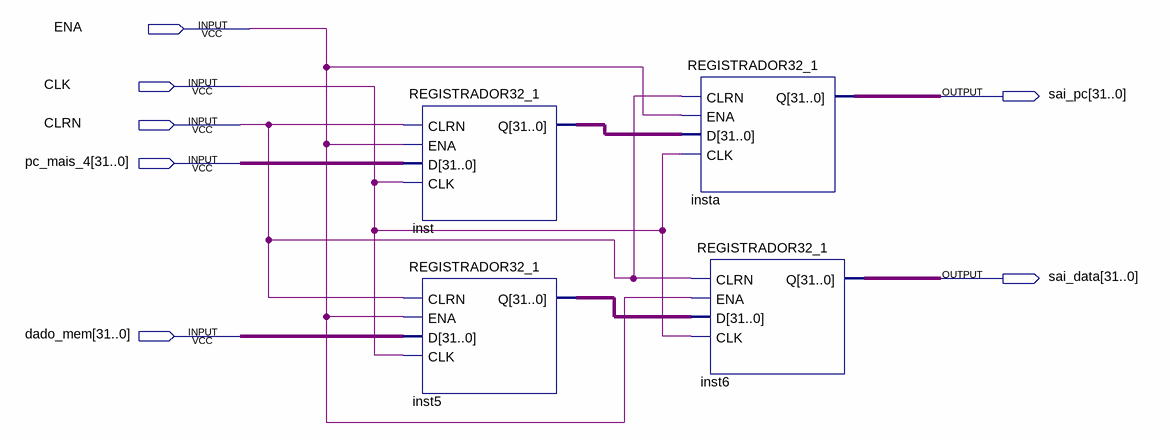
[diagram p0: schematic sheet]
// Quartus schematic IF_PARA_ID.bdf as structural Verilog: 4 symbols, 7 pins
module IF_PARA_ID (
  input  ENA,
  input  CLK,
  input  CLRN,
  input  [31:0] pc_mais_4,
  input  [31:0] dado_mem,
  output [31:0] sai_pc,
  output [31:0] sai_data
);

  wire [31:0] inst5_q, inst_q;

  REGISTRADOR32_1 inst (.CLRN(CLRN), .ENA(ENA), .D(pc_mais_4), .CLK(CLK), .Q(inst_q));
  REGISTRADOR32_1 inst5 (.CLRN(CLRN), .ENA(ENA), .D(dado_mem), .CLK(CLK), .Q(inst5_q));
  REGISTRADOR32_1 insta (.CLRN(CLRN), .ENA(ENA), .D(inst_q), .CLK(CLK), .Q(sai_pc));
  REGISTRADOR32_1 inst6 (.CLRN(CLRN), .ENA(ENA), .D(inst5_q), .CLK(CLK), .Q(sai_data));
endmodule
